# Altium project Powerboard_2.PrjPcb
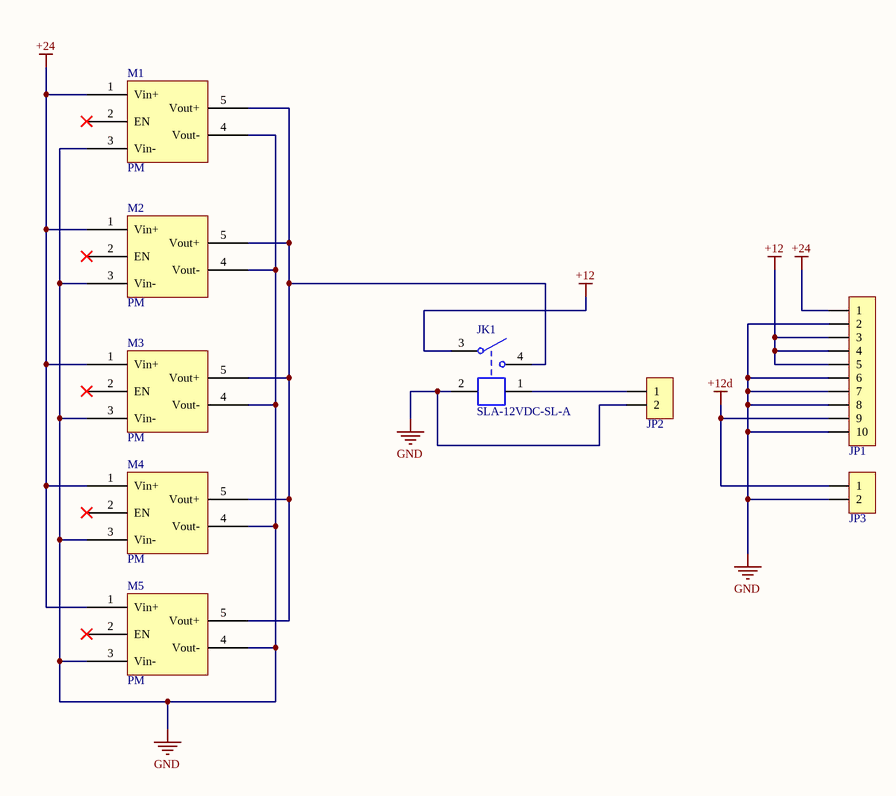
[diagram p0: board.SchDoc]
1 sheet, 9 parts. Net scope: global (net labels, ports and power ports of the same name join across sheets).
Board file: board.PcbDoc

## Sheet board.SchDoc
size A4; SheetNumber: 1; SheetTotal: 1

### Parts
JK1  SLA-12VDC-SL-A  [SLA-xxVDC-SL-A]
JP1  HDR-1X10  [KF7620-10P]  (value not drawn)
JP2  HDR-1X2  [PH2.0-LI-2P]  (value not drawn)
JP3  HDR-1X2  [KF7620-2P]  (value not drawn)
M1  PM  [PM]
M2  PM  [PM]
M3  PM  [PM]
M4  PM  [PM]
M5  PM  [PM]

### Nets
+12: JK1.3 JP1.3 JP1.4 JP1.5
+12d: JP1.9 JP3.1
+24: JP1.1 M1.1(Vin+) M2.1(Vin+) M3.1(Vin+) M4.1(Vin+) M5.1(Vin+)
GND: JK1.2 JP1.2 JP1.6 JP1.7 JP1.8 JP1.10 JP2.2 JP3.2 M1.3(Vin-) M1.4(Vout-) M2.3(Vin-) M2.4(Vout-) M3.3(Vin-) M3.4(Vout-) M4.3(Vin-) M4.4(Vout-) M5.3(Vin-) M5.4(Vout-)
NetJK1_1: JK1.1 JP2.1
NetJK1_4: JK1.4 M1.5(Vout+) M2.5(Vout+) M3.5(Vout+) M4.5(Vout+) M5.5(Vout+)

Not connected (* = marked no-connect by the designer): M1 2(EN)*; M2 2(EN)*; M3 2(EN)*; M4 2(EN)*; M5 2(EN)*

### Library data of the parts
JK1 = SLA-12VDC-SL-A: 12V一组常开; BOM名称: 12V继电器; 版权归属: 源创客; 学习资源: www.ooocke.com
JP1 = Header 10: 10P接插件; 版权归属: 源创客; BOM名称: 10P接插件; 学习资源: www.ooocke.com
JP2 JP3 = Header 2: 2P接插件; 版权归属: 源创客; BOM名称: 2P接插件; 学习资源: www.ooocke.com